# EAGLE design Jack (EAGLE 6.5.0)
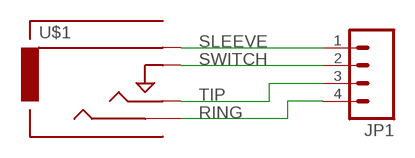
[diagram p0: schematic, sheet 1]

## Parts
JP1  M04PTH  [1X04]
U$1  AUDIO-JACKINPUT  [3.5MM-JACK-SWITCH-13MM-INPUT]

## Nets
RING: JP1.4 U$1.SECOND@1(SECOND) U$1.SECOND@2(SECOND)
SLEEVE: JP1.1 U$1.RING@1(RING) U$1.RING@2(RING)
SWITCH: JP1.2 U$1.SWITCH@1(SWITCH) U$1.SWITCH@2(SWITCH)
TIP: JP1.3 U$1.TIP@1(TIP) U$1.TIP@2(TIP)

## Library data of the parts
JP1 = SparkFun-Connectors:M04: Header 4 Standard 4-pin 0.1" header. Use with straight break away headers (SKU : PRT-00116), right angle break away headers (PRT-00553), swiss pins (PRT-00743), machine pins (PRT-00117), and female headers (PRT-00115). Molex polarized connector foot print use with SKU : PRT-08231 with associated crimp pins and housings. 1MM SMD Version SKU: PRT-10208
U$1 = EurorackModularParts:AUDIO-JACK: Switching Mono 3.5mm Audio Jack from Erthenvar.

## Net classes
0 default: width 0.254 mm

## Board
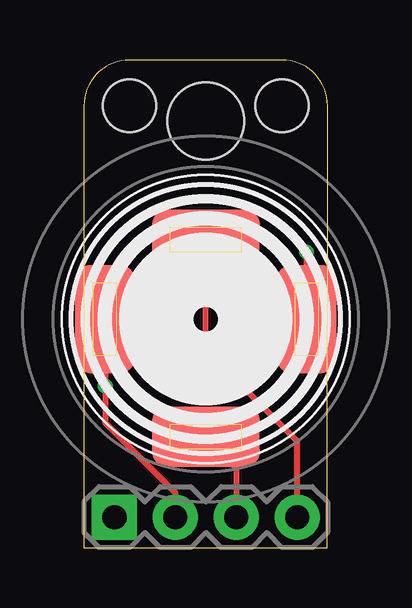
[diagram p1: board, top side]
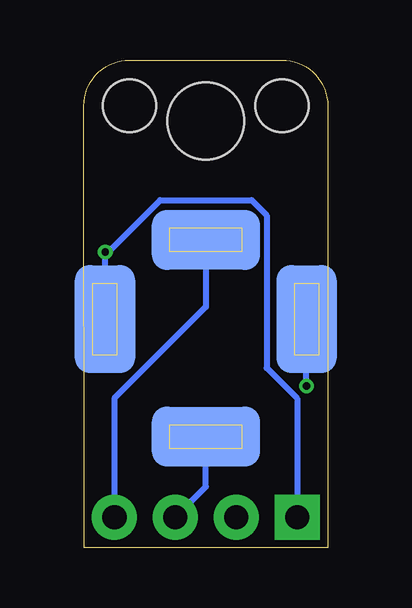
[diagram p2: board, bottom side, seen from below]

Size 10.16 x 20.32 mm. Coordinates in mm from the lower left corner, seen from the top.
Outline: 0,0 10.14,0 10.16,18.41 arc90 8.25,20.32 1.91,20.32 arc90 0,18.41 0,0
Copper layers (1*16): Top 0.035mm / dielectric 1.5mm / Bottom 0.035mm
Design rules "ITEADstudio_DRC": minimum track width 6mil, minimum drill 12mil, track to track 6mil, track to pad 6mil, pad to pad 6mil, via to via 6mil, smd to smd 0mil, copper to edge 10mil, drill to drill 10mil, minimum pad ring 10mil, minimum via ring 6mil, stop-mask expansion 2mil, vias tented up to drill 100mil, thermal gap 10mil
Holes 3.2 mm at 5.08,17.78
Holes 2.2 mm at 1.91,18.41 8.26,18.41

### Footprints (pad centres in the part's own frame; a part is rotated, then mirrored left to right if it is on the bottom)
1X04 = drill 1.016 pad 1.88 square: 1 0,0 | drill 1.016 pad 1.88: 2 2.54,0; 3 5.08,0; 4 7.62,0
3.5MM-JACK-SWITCH-13MM-INPUT = smd 2.5 x 4.5: RING@1 -4.2,0; SWITCH@1 4.2,0 | smd 2.5 x 4.5 bottom: RING@2 -4.2,0; SWITCH@2 4.2,0 | smd 4.5 x 2.5: SECOND@1 0,-3.3; TIP@1 0,4.9 | smd 4.5 x 2.5 bottom: SECOND@2 0,-3.3; TIP@2 0,4.9

### Placement (x,y rotation side)
JP1  1.27,1.27 0 top
U$1  5.08,9.53 180 top

### Tracks (layer width: path | path; a pad name or v marks a point on that pad's centre or on a via)
RING
  Top 0.254: U$1.SECOND@2 5.08,8.26 8.89,4.45 JP1.4
  Bottom 0.254: JP1.4 8.89,6.22 5.08,10.03 U$1.SECOND@2
SLEEVE  (via drill 0.3)
  Top 0.254: v9.27,12.32 U$1.RING@2
  Bottom 0.254: JP1.1 1.27,6.22 2.54,7.49 2.54,13.84 3.17,14.48 6.99,14.48 9.21,12.26 | 9.21,12.26 9.27,12.19 U$1.RING@2 | v9.27,12.32 9.21,12.26
SWITCH  (via drill 0.3)
  Top 0.254: JP1.2 3.81,2.29 0.89,5.21 v0.89,6.73 U$1.SWITCH@2
  Bottom 0.254: v0.89,6.73 U$1.SWITCH@2
TIP
  Top 0.254: JP1.3 6.35,3.3 5.08,4.57 U$1.TIP@2
  Bottom 0.254: U$1.TIP@2 5.08,2.54 JP1.3